# Altium schematic sheet Voltmeter_Before.SchDoc
size A4
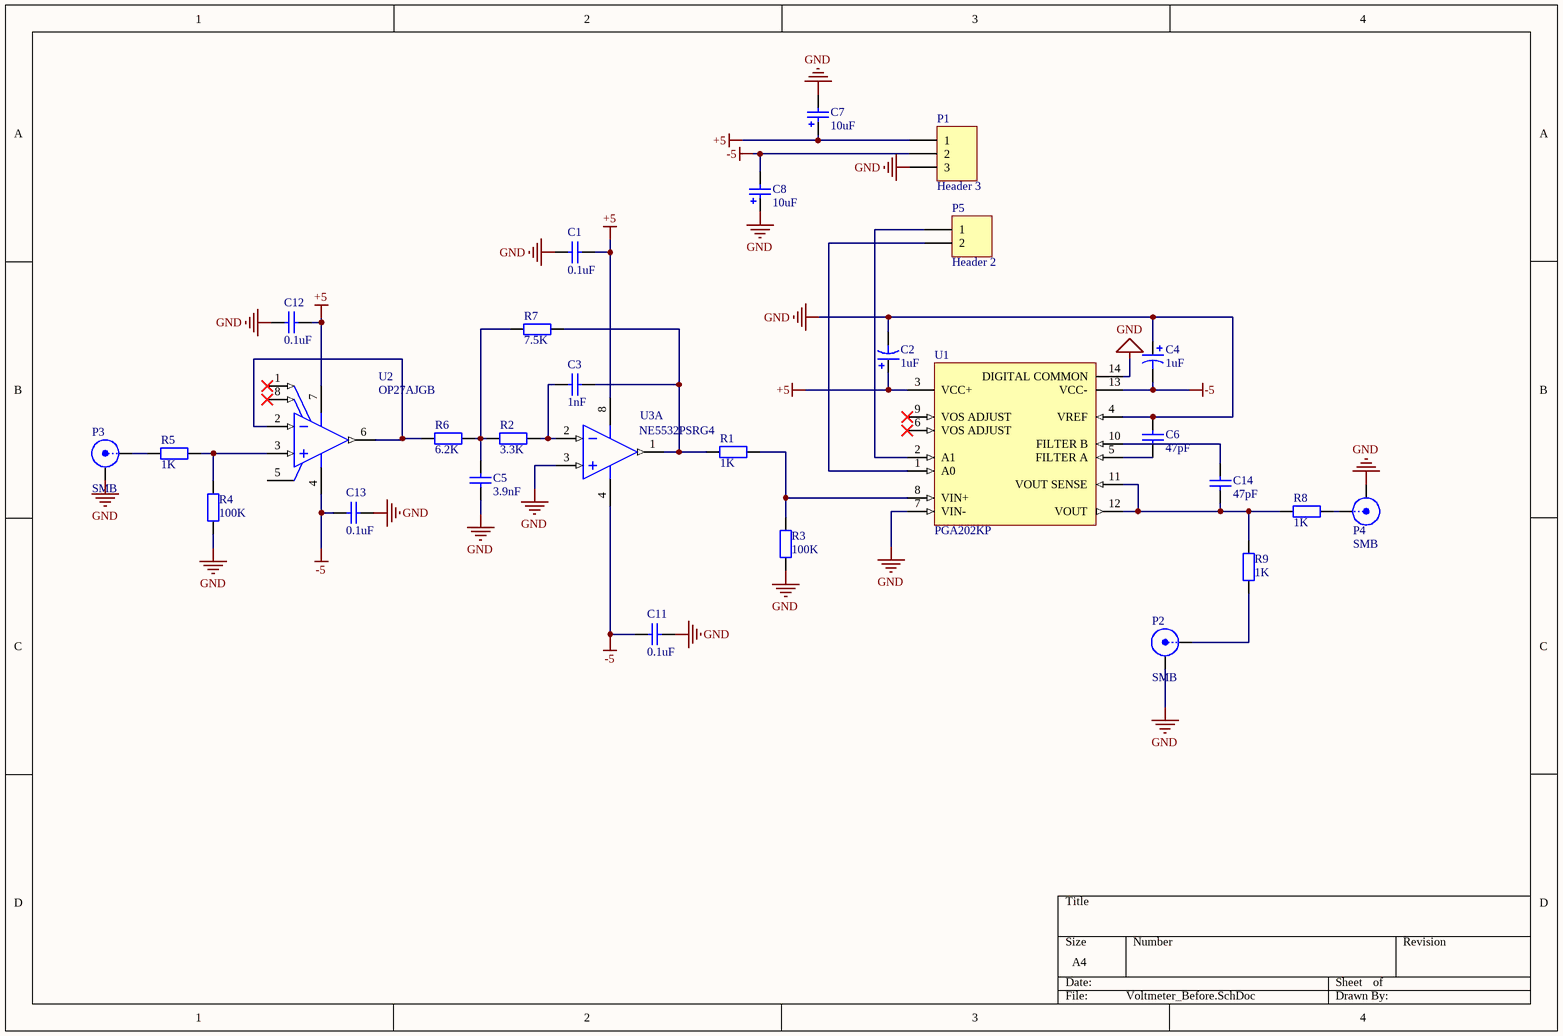
[diagram p0: Voltmeter_Before.SchDoc]

## Parts
C1  value 0.1uF  [C0805]  (hidden comment: Cap Semi)
C2  value 1uF  [C0805]  (hidden comment: Cap Pol3)
C3  value 1nF  [C0805]  (hidden comment: Cap Semi)
C4  value 1uF  [C0805]  (hidden comment: Cap Pol3)
C5  value 3.9nF  [C0805]  (hidden comment: Cap Semi)
C6  value 47pF  [C0805]  (hidden comment: Cap Semi)
C7  value 10uF  [C0805]  (hidden comment: Cap Pol2)
C8  value 10uF  [C0805]  (hidden comment: Cap Pol2)
C11  value 0.1uF  [C0805]  (hidden comment: Cap Semi)
C12  value 0.1uF  [C0805]  (hidden comment: Cap Semi)
C13  value 0.1uF  [C0805]  (hidden comment: Cap Semi)
C14  value 47pF  [C0805]  (hidden comment: Cap Semi)
P1  Header 3  [HDR1X3]
P2  SMB  [SMB_V-RJ45]
P3  SMB  [SMB_V-RJ45]
P4  SMB  [SMB_V-RJ45]
P5  Header 2  [HDR1X2]
R1  value 1K  [C0805]  (hidden comment: Res2)
R2  value 3.3K  [C0805]  (hidden comment: Res2)
R3  value 100K  [C0805]  (hidden comment: Res2)
R4  value 100K  [C0805]  (hidden comment: Res2)
R5  value 1K  [C0805]  (hidden comment: Res2)
R6  value 6.2K  [C0805]  (hidden comment: Res2)
R7  value 7.5K  [C0805]  (hidden comment: Res2)
R8  value 1K  [C0805]  (hidden comment: Res2)
R9  value 1K  [C0805]  (hidden comment: Res2)
U1  PGA202KP  [TI-N14]
U2  OP27AJGB  [TI-JG8]
U3  NE5532PSRG4  [DIP-8]  (part A of 2)

## Nets
+5: C1.1 C2.1 C7.1 C12.2 P1.1 U1.3(VCC+) U2.7(VCC+) U3.8(VCC+)
-5: C4.2 C8.2 C11.2 C13.1 P1.2 U1.13(VCC-) U2.4(VCC-) U3.4(VCC-)
GND: C1.2 C2.2 C4.1 C5.1 C6.2 C7.2 C8.1 C11.1 C12.1 C13.2 P1.3 P2.2(Y) P3.2(Y) P4.2(Y) R3.1 R4.1 U1.4(VREF) U1.7(VIN-) U1.14(DIGITAL_COMMON) U3.3(IN1+)
NetC3_1: C3.1 R1.1 R7.1 U3.1(OUT1)
NetC3_2: C3.2 R2.2 U3.2(IN1-)
NetC5_2: C5.2 R2.1 R6.2 R7.2
NetC6_1: C6.1 U1.5(FILTER_A)
NetC14_1: C14.1 R8.1 R9.2 U1.11(VOUT_SENSE) U1.12(VOUT)
NetC14_2: C14.2 U1.10(FILTER_B)
NetP2_1: P2.1(X) R9.1
NetP3_1: P3.1(X) R5.1
NetP4_1: P4.1(X) R8.2
NetP5_1: P5.1 U1.2(A1)
NetP5_2: P5.2 U1.1(A0)
NetR1_2: R1.2 R3.2 U1.8(VIN+)
NetR4_2: R4.2 R5.2 U2.3(IN+)
NetR6_1: R6.1 U2.2(IN-) U2.6(OUT)

Not connected (* = marked no-connect by the designer): U1 6(VOS_ADJUST)* 9(VOS_ADJUST)*; U2 1(VIOTRIM)* 5(NC) 8(VIOTRIM)*

## Library data of the parts
C1 C3 C5 C6 C11-C14 = Cap Semi: Capacitor (Semiconductor SIM Model); Published: 8-Jun-2000; LatestRevisionDate: 29-May-2009; LatestRevisionNote: IPC-7351 Footprint Added.; PackageReference: C1206; Publisher: Altium Limited; PackageDescription: Chip Capacitor
C2 C4 = Cap Pol3: Polarized Capacitor (Surface Mount); Published: 8-Jun-2000; LatestRevisionDate: 29-May-2009; LatestRevisionNote: IPC-7351 Footprint Added.; PackageReference: C0805; Publisher: Altium Limited; PackageDescription: Chip Capacitor
C7 C8 = Cap Pol2: Polarized Capacitor (Axial); Published: 8-Jun-2000; LatestRevisionDate: 17-Jul-2002; LatestRevisionNote: Re-released for DXP Platform.; PackageReference: POLAR0.8; Publisher: Altium Limited; PackageDescription: Polarized Capacitor; 2 Leads
P1 = Header 3: Header, 3-Pin; LatestRevisionDate: 17-Jul-2002; LatestRevisionNote: Re-released for DXP Platform.; Publisher: Altium Limited
P2-P4 = SMB: SMB Straight Connector; LatestRevisionDate: 17-Jul-2002; LatestRevisionNote: Re-released for DXP Platform.; Publisher: Altium Limited
P5 = Header 2: Header, 2-Pin; LatestRevisionDate: 17-Jul-2002; LatestRevisionNote: Re-released for DXP Platform.; Publisher: Altium Limited
R1-R9 = Res2: Resistor; Published: 8-Jun-2000; LatestRevisionDate: 17-Jul-2002; LatestRevisionNote: Re-released for DXP Platform.; PackageReference: AXIAL-0.4; Publisher: Altium Limited; PackageDescription: Axial Device, Thru-Hole; 2 Leads; 0.4 in Pin Spacing
U1 = PGA202KP: Digitally Controlled Programmable-Gain Instrumentation Amplifier, -25 to 85 degC, 14-pin DIP (N14), Green (RoHS & no Sb/Br); Manufacturer: Texas Instruments; Common Mode Input High(Min)(V): 10; Common Mode Input Low(Min)(V): -10; Gain Error (+/-)(Max)(%): 0.25; Gain(V/V): 1, 10, 100, 1000; Input Bias Current (+/-)(Max)(nA): 0.05; Non-Linearity (+/-)(Max)(%): 0.015; Number of Channels: 1; Quiescent Current (+/-)(Typ)(mA): 6.5; Settling Time to 0.01%(Typ)(us): 2; Slew Rate(Typ)(V/us): 20; SubFamily: Programmable Gain Amplifier; Vs(Max)(V): 36; Vs(Min)(V): 12; DatasheetVersion: SBOS002; PackageVersion: 4040049/E, 12/2002; PackageReference: N14; PackageDescription: 14-Pin Plastic In-Line, Body 19.305 x 6.35 mm, Pitch 2.54 mm; Supplier 1: Digi-Key; Supplier Part Number 1: PGA202KP-ND; Supplier 2: Farnell; Supplier Part Number 2: 1648647; Supplier 3: Newark; Supplier Part Number 3: 80K6038; Supplier 4: Mouser; Supplier Part Number 4: 595-PGA202KP; Eco-Plan: Green (RoHS & no Sb/Br); Mounting Technology: Through Hole; Code_JEDEC: MS-001; PartNumber: PGA202KP; ComponentLink1Description: Manufacturer URL; ComponentLink1URL: http://www.ti.com/; ComponentLink2Description: Datasheet; ComponentLink2URL: http://www.ti.com/general/docs/lit/getliterature.tsp?genericPartNumber=PGA202&fileType=pdf; ComponentLink3Description: Package Specification; ComponentLink3URL: http://www.ti.com/lit/ml/mpdi002c/mpdi002c.pdf
U2 = OP27AJGB: Low-Noise Precision High-Speed Operational Amplifier, 8 to 44 V, -55 to 125 degC, 8-pin DIP (JG8); Manufacturer: Texas Instruments; CMRR(Min)(dB): 114; GBW(Typ)(MHz): 8; IIB(Max)(pA): 40000; Number of Channels: 1; Offset Drift(Typ)(uV/C): 0.2; Packing: TUBE; Rating: Military; Slew Rate(Typ)(V/us): 2.8; Sub Family: High Supply Voltage Amplifier (>=30V), Low Noise Amp (<=10nV/rtHz), Low Offset Voltage Amplifier (<=500uV), Precision Amplifier; Total Supply Voltage(Max)(+5V is 5, +/-5V is 10): 44; Vio (25C)(Max)(mV): 0.025; DatasheetVersion: SLOS100E; PackageVersion: 4040107/C, 08/1996; PackageReference: JG8; PackageDescription: 8-Pin Ceramic, Glass In-Line, Body 9.58 x 6.665 mm, Pitch 2.54 mm; Total Supply Voltage(Min)(+5V is 5, +/-5V is 10): 8; Mounting Technology: Through Hole; PartNumber: OP27AJGB; ComponentLink1Description: Manufacturer URL; ComponentLink1URL: http://www.ti.com/; ComponentLink2Description: Datasheet; ComponentLink2URL: http://www.ti.com/lit/ds/symlink/op27.pdf; ComponentLink3Description: Package Specification; ComponentLink3URL: http://www.ti.com/litv/pdf/mcer001a
U3 = NE5532PSRG4: Dual Low-Noise High-Speed Audio Operational Amplifier, 10 to 30 V, 0 to 70 degC, 8-pin SOP (PS8), Green (RoHS & no Sb/Br); Manufacturer: Texas Instruments; CMRR(Min)(dB): 70; GBW(Typ)(MHz): 10; IIB(Max)(pA): 800000; Iq per channel(Max)(mA): 4; Number of Channels: 2; Slew Rate(Typ)(V/us): 9; Sub Family: General Purpose Amplifier, High Supply Voltage Amplifier (>=30V), Low Noise Amp (<=10nV/rtHz); Total Supply Voltage(Max)(+5V is 5, +/-5V is 10): 30; Vn at 1kHz(Typ)(nV/rtHz): 5; DatasheetVersion: SLOS075I; PackageVersion: 4040063/C, 03/2003; PackageReference: PS8; PackageDescription: 8-Pin Plastic Small Outline, Body 5.3 x 6.2 mm, Pitch 1.27 mm; Supplier 1: Digi-Key; Supplier Part Number 1: NE5532PSRG4-ND; Supplier 2: Newark; Supplier Part Number 2: 46M6753; Supplier 3: Mouser; Supplier Part Number 3: 595-NE5532PSRG4; Eco-Plan: Green (RoHS & no Sb/Br); Total Supply Voltage(Min)(+5V is 5, +/-5V is 10): 10; Vio (25C)(Max)(mV): 4; Mounting Technology: Surface Mount; PartNumber: NE5532PSRG4; ComponentLink1Description: Manufacturer URL; ComponentLink1URL: http://www.ti.com/; ComponentLink2Description: Datasheet; ComponentLink2URL: http://www.ti.com/lit/ds/symlink/ne5532.pdf; ComponentLink3Description: Package Specification; ComponentLink3URL: http://www.ti.com/litv/pdf/msop001a